# Altium schematic sheet Switch.SchDoc
size A; SheetNumber: 1; SheetTotal: 1
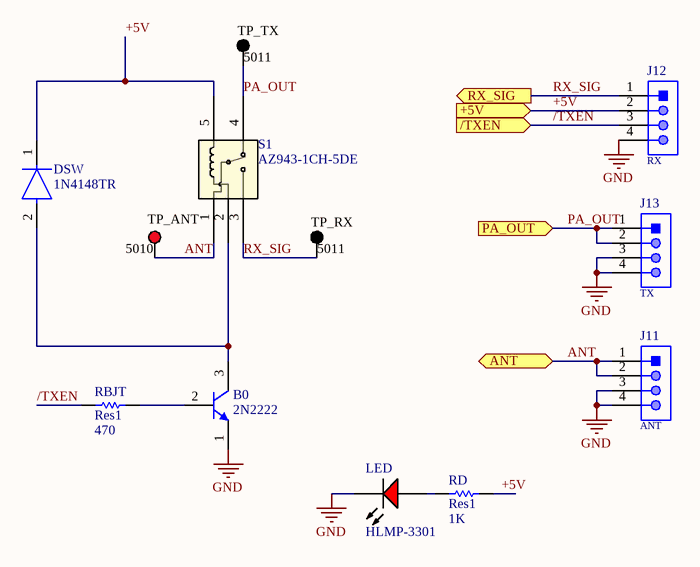
[diagram p0: Switch.SchDoc]

## Parts
B0  2N2222  [MLTC-TO-18-3]
DSW  1N4148TR  [FP-6_560-5004_12-4-MFG]
J11  ANT  [61300411121]
J12  RX  [61300411121]
J13  TX  [61300411121]
LED  HLMP-3301  [AVAG-HLMP-3301-2]
RBJT  Res1  value 470  [AXIAL-0.1-RES]
RD  Res1  value 1K  [AXIAL-0.1-RES]
S1  AZ943-1CH-5DE  [K_AZ943-1C_AMZ]
TP_ANT  5010  [KSTN-5010_V]
TP_RX  5011  [KSTN-5011_V]
TP_TX  5011  [KSTN-5011_V]

## Ports
+5V (in), /TXEN (in), ANT (bidir), PA_OUT (in), RX_SIG (out)

## Nets
GND: B0.1(E) J11.3 J11.4 J12.4 J13.3 J13.4 LED.1(K)
+5V: DSW.1(C) J12.2 RD.2 S1.5 ; port +5V
/TXEN: J12.3 RBJT.1 ; port /TXEN
ANT: J11.1 J11.2 S1.1 TP_ANT.1 ; port ANT
PA_OUT: J13.1 J13.2 S1.4 TP_TX.1 ; port PA_OUT
RX_SIG: J12.1 S1.3 TP_RX.1 ; port RX_SIG
NetB0_2: B0.2(B) RBJT.2
NetB0_3: B0.3(C) DSW.2(A) S1.2
NetLED_2: LED.2(A) RD.1

## Library data of the parts
B0 = CMP-2000-05237-1: Low Power Bipolar NPN Transistor, 30 V, -65 to 200 degC, 3-Pin TO-18, RoHS, Bulk; Manufacturer: Multicomp; Pin Configuration: a; No. of Pins: 3; No. of Transistors: 1; Collector Emitter Voltage Vces: 400mV; Current Ic Continuous a Max: 800mA; Power Dissipation Pd: 500mW; Collector Emitter Voltage V(br)ceo: 30V; Gain Bandwidth ft Typ: 250MHz; Voltage Vcbo: 60V; DC Current Gain hFE: 100; Full Power Rating Temperature: 25degC; Current Ic @ Vce Sat: 150mA; SVHC: NoSVHC(19-Dec-2012); Package Reference: TO-18-3; Package Description: 3-Pin Transistor Outline Package (TO-18), Dia 5.54 mm, Pitch Pitch 1.485mm; Datasheet URL: http://www.farnell.com/datasheets/1662272.pdf; Transistor Case Style: TO-18; Continuous Collector Current Ic Max: 800mA; Manufacturer URL: http://uk.farnell.com/b/multicomp; DC Collector Current: 800mA; Hfe Min: 100; Transistor Polarity: NPN; Power Dissipation Ptot Max: 500mW; Package / Case: TO-18; Datasheet Version: Rev. 1.1, 05/2012; Gain Bandwidth ft Min: 250MHz; Current Ic hFE: 150mA
DSW = CMP-02540-000029-2: DIODE GEN PURP 75V 300MA DO35; Element Configuration: Single; Power Dissipation: 440mW; Reverse Recovery Time: 8ns; Peak Non-Repetitive Surge Current: 2A; Max Repetitive Reverse Voltage (Vrrm): 100V; Forward Voltage: 1V; Current Rating: 150A; Number of Pins: 2; Packaging: Tape and Reel; Mount: Through Hole; Forward Current: 300mA; Lead Free: Lead Free; Max Operating Temperature: 175°C; Min Operating Temperature: -65°C
J11-J13 = CMP-1502-01064-1: THT Vertical Pin Header WR-PHD, Pitch 2.54 mm, Single Row, 4 pins; Manufacturer: Wurth Elektronik; Withstanding Voltage: 500VAC; Rated Current: 3A; Working Voltage: 250VAC; Pin Number: 4; Gender: Male; Contact Resistance: 20mOhm; Pitch: 2.54mm; Manufacturer URL: http://www.we-online.de; Operating Temperature: -40to105degC; Packaging: Bag; Mounting Technology: THT; Package Reference: 61300411121; Datasheet URL: https://katalog.we-online.de/em/datasheet/6130xx11121.pdf; Publisher: WurthElektronik; Part Number: 61300411121; Row Number: Single; Orientation: Vertical
LED = CMP-2000-06411-1: T-1 3/4 (5 mm) Diffused LED Lamp, 1.9 V, -40 to 100 degC, 2-Pin THD, RoHS, Bulk; Manufacturer: Avago; Forward Current: 25mA; Forward Voltage: 2.4V; Peak Wavelength: 635nm; Shape Type: Circular; High Brightness: No; Main Category: StandardLED; Test Current (It): 10mA; Dominant Wave Length: 626nm; Number of  Elements: 1; Reverse Voltage: 5V; Chip Material: GaP; Product Height (mm): 9.19mm; Lens Type: ColoredDiffused; Viewing Angle: 60deg; Emitting Color: Red; Luminous Intensity: 5.4mcd; Power Dissipation: 85W; DELETED: Compliant; Product Depth (mm): 6.1mm; Package Description: 2-Pin Through Hole LED, Dia 5.85 mm; Mounting Technology: ThroughHole; Manufacturer URL: http://www.avagotech.com/; Package Type: T-13/4; Operating Temp Range: -40Cto100C; Datasheet URL: http://www.avagotech.com/docs/AV02-1558EN; Mounting: ThroughHole; Lens Dimensions: 5.08x5.08x8.3mm; Package Reference: HLMP-3301; Datasheet Version: 03/2015; Pin Count: 2; Packaging: TapeandReel; Type: Uni-Color; Operating Temperature Classification: Industrial; Lum Intensity: 5.4mcd; Rad Hardened: No; Product Length (mm): 6.1mm
RBJT = RES 470 OHM 5% 1/4W AXIAL: Resistor; Manufacturer Part Number: CFR-25JB-52-470R; Designator: R?; Power Rating: 1/4W; Tolerance: 0.05; Published: 8-Jun-2000; LatestRevisionDate: 17-Jul-2002; LatestRevisionNote: Re-released for DXP Platform.; Publisher: Altium Limited
RD = RES 1K OHM 5% 1/4W AXIAL: Resistor; Manufacturer Part Number: CFR-25JB-52-1K; Designator: R?; Power Rating: 1/4W; Tolerance: 0.05; Published: 8-Jun-2000; LatestRevisionDate: 17-Jul-2002; LatestRevisionNote: Re-released for DXP Platform.; Publisher: Altium Limited
S1 = AZ943-1CH-5DE: No Description Available; Mfr_Name: American Zettler; Type: Power Relays; RefDes: RefDes
TP_ANT = CMP-1672-00002-4: Test Point, Red, Through Hole, RoHS, Bulk; Manufacturer: Keystone; Contact Material: Bronze; Mounting Technology: Through Hole; RoHSCompliant: true; Pins: 1; Package Quantity: 100; ComponentLink2Description: Datasheet; Height: 8.12 mm; ComponentLink1URL: http://www.keyelco.com/; DatasheetVersion: Rev. F, 12/2013; Mount: Through Hole; PackageReference: 5010; Contact Plating: Silver; Packaging: Bulk; Colour: Red; REACH SVHC: No SVHC; PackageDescription: 1-Pin Through Hole Device, Dia 3.17 mm; ComponentLink2URL: http://www.keyelco.com/product-pdf.cfm?p=1319; ComponentLink1Description: Manufacturer URL
TP_RX TP_TX = CMP-1672-00003-4: Test Point, Black, Through Hole, RoHS, Bulk; Manufacturer: Keystone; ComponentLink2URL: http://www.keyelco.com/product-pdf.cfm?p=1320; Colour: Black; Pins: 1; REACH SVHC: No SVHC; ComponentLink1URL: http://www.keyelco.com/; PackageReference: 5011; Contact Plating: Silver; Package Quantity: 100; Packaging: Bulk; RoHSCompliant: true; Height: 8.12 mm; PackageDescription: 1-Pin Through Hole Device, Dia 3.17 mm; Mount: Through Hole; Mounting Technology: Through Hole; DatasheetVersion: Rev. F, 12/2013; ComponentLink1Description: Manufacturer URL; Contact Material: Bronze; ComponentLink2Description: Datasheet